# EasyEDA Pro project Adorkable_Base_V2.eprj

# Schematic Schematic1
Board Name: Board1; Create Date: 2024-12-17; Page Name: P1; Project Name: Adorkable_Base_V2; Schematic Name: Schematic1; Update Date: 2025-04-10; Company: 嘉立创EDA; Page Size: A4; Version: V1.0
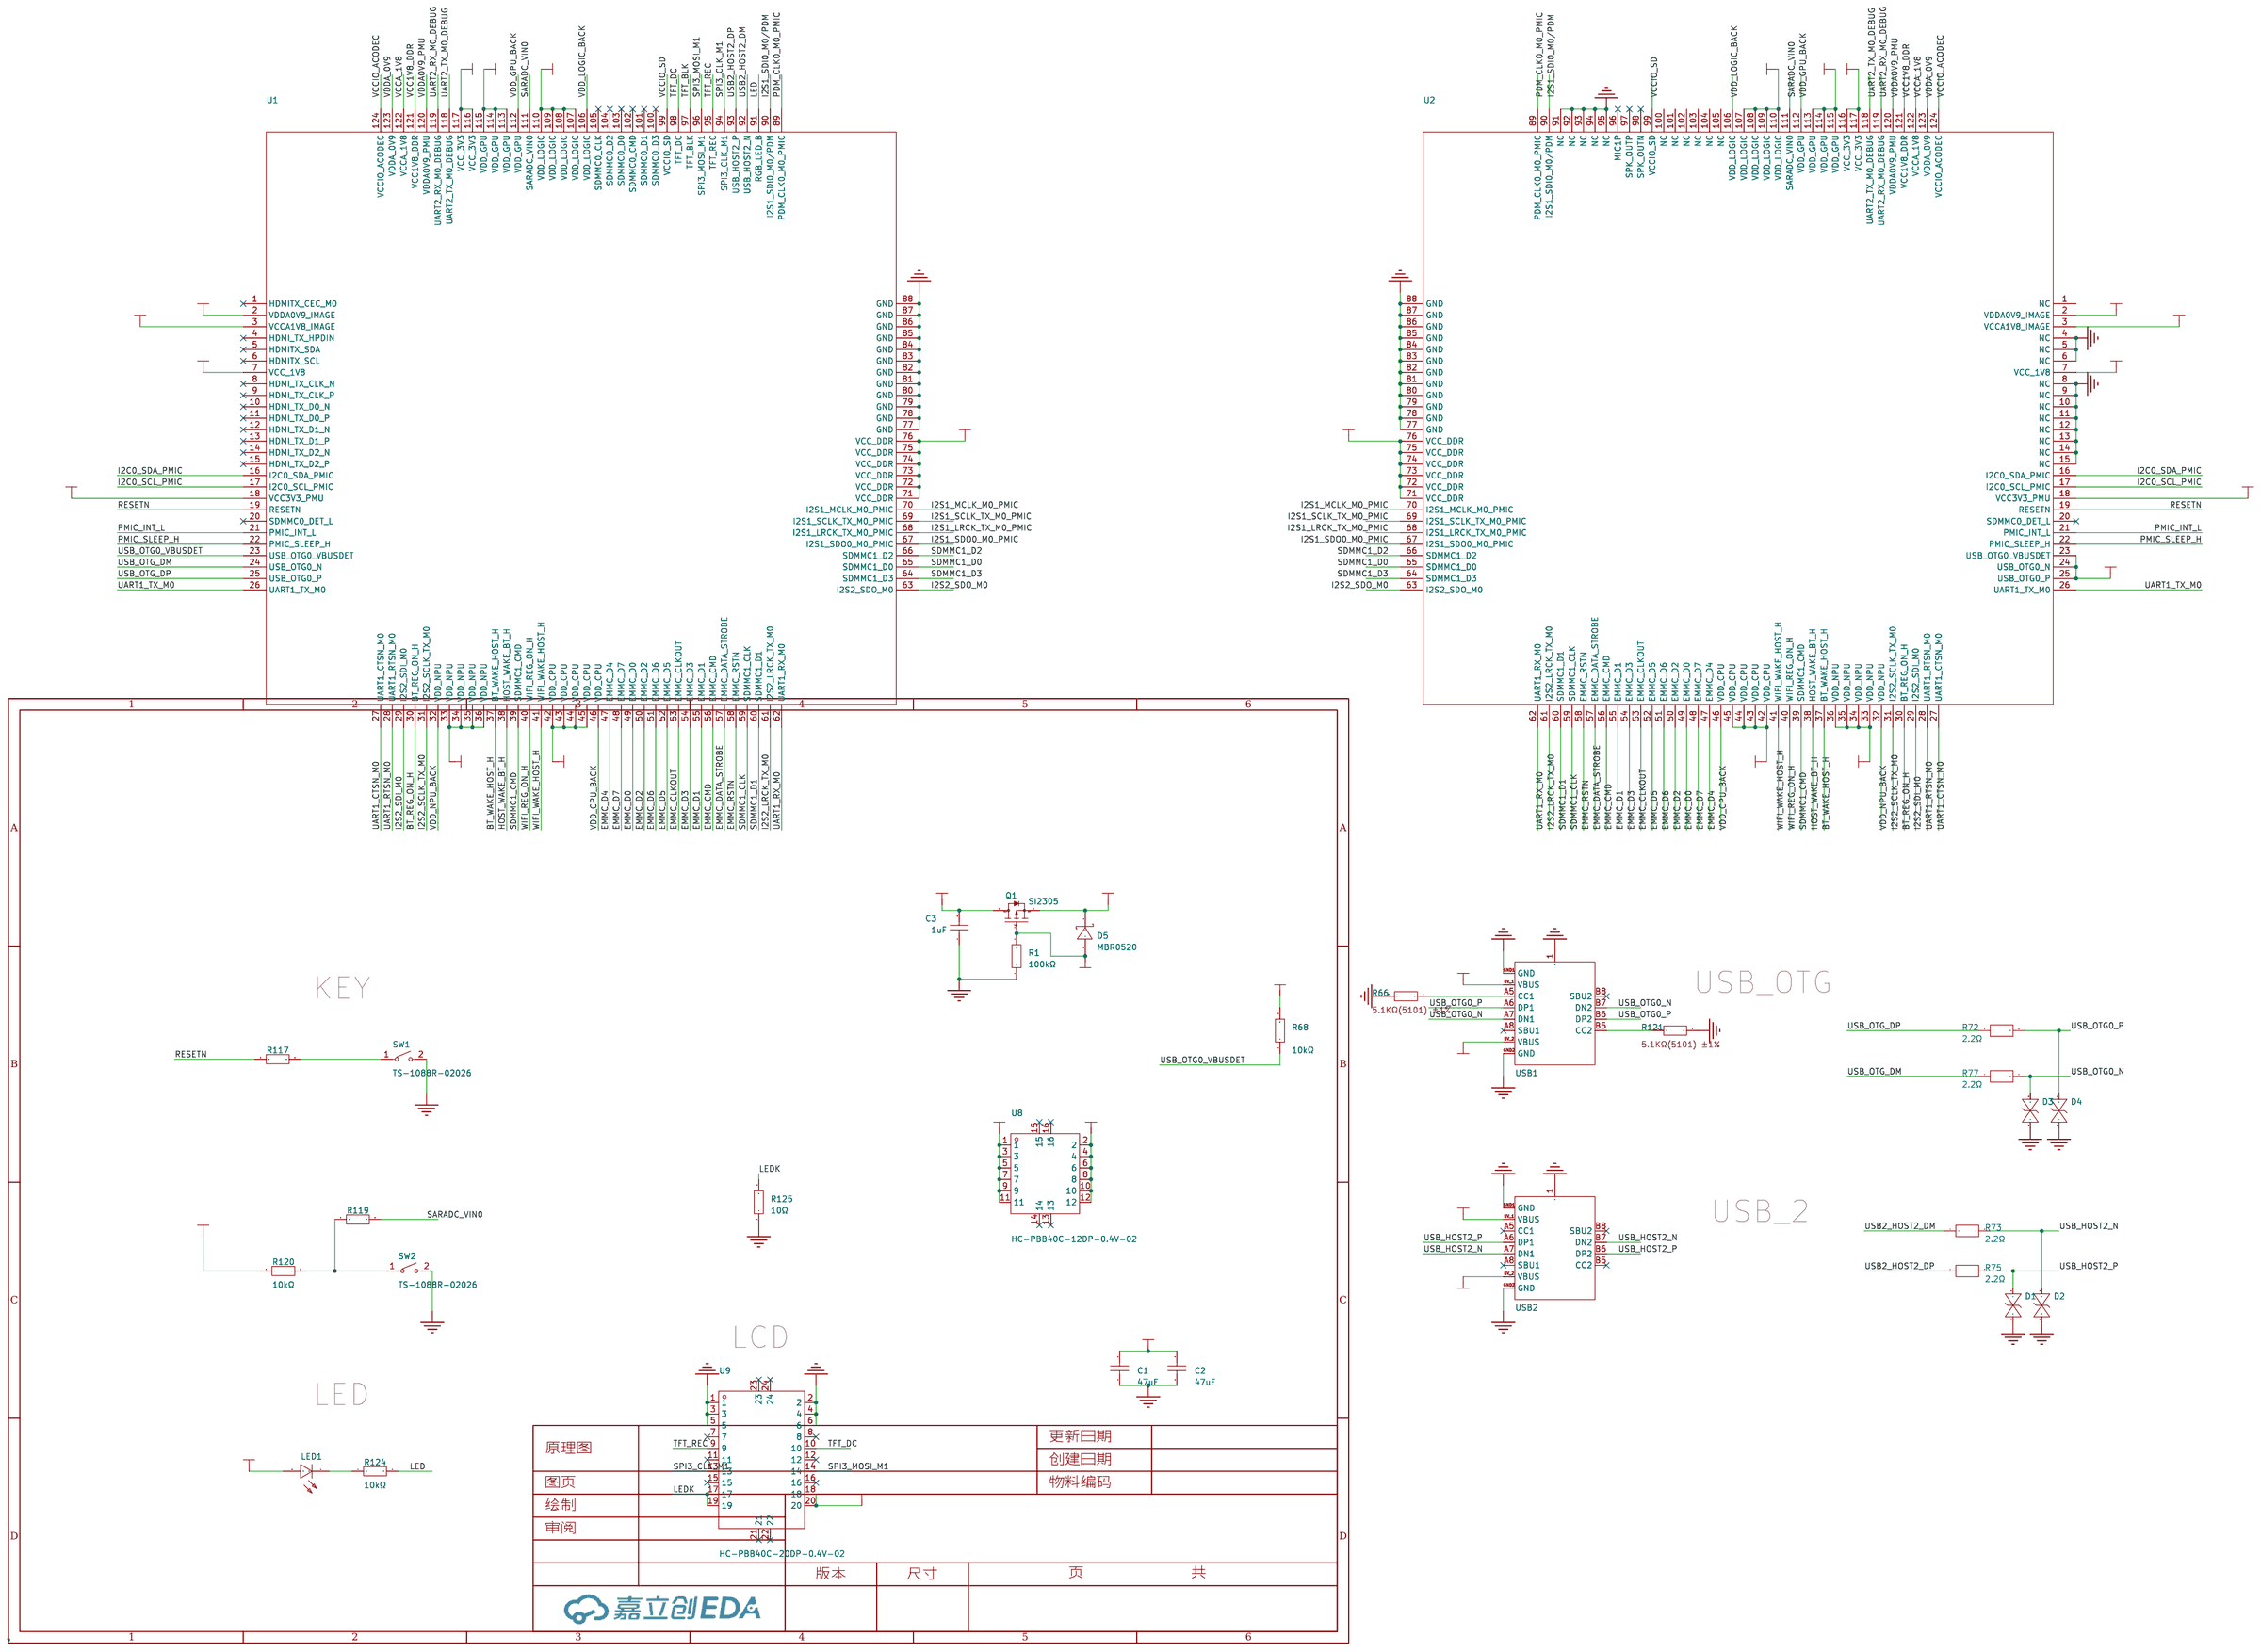
[diagram p0: schematic sheet]

## Parts
C1  47uF  [C0603]
C2  47uF  [C0603]
C3  1uF  [R0402]
D1  KLXES15AAA1  [R0402]
D2  KLXES15AAA1  [R0402]
D3  KLXES15AAA1  [R0402]
D4  KLXES15AAA1  [R0402]
D5  MBR0520  [SOD-123_L2.8-W1.8-LS3.7-RD]
LED1  19-217/GHC-YR1S2/3T  [LED0603-RD]
Q1  SI2305  [SOT-23-3_L2.9-W1.3-P1.90-LS2.4-BR]
R1  100kΩ  [R0402]
R66  0402WGF5101TCE  [R0402]
R68  10kΩ  [R0402]
R72  2.2Ω  [R0402]
R73  2.2Ω  [R0402]
R75  2.2Ω  [R0402]
R77  2.2Ω  [R0402]
R117  0402WGF1000TCE  [R0402]
R119  0402WGF1000TCE  [R0402]
R120  10kΩ  [R0402]
R121  0402WGF5101TCE  [R0402]
R124  10kΩ  [R0402]
R125  10Ω  [R0402]
SW1  TS-1088R-02026  [SW-SMD_L3.9-W3.0-P4.45]
SW2  TS-1088R-02026  [SW-SMD_L3.9-W3.0-P4.45]
U1  -  [Core]
U2  -  [EXP]
U8  HC-PBB40C-12DP-0.4V-02  [CONN-SMD_12P-P0.40_HCTL_HC-PBB40C-12DP-0.4V-02]
U9  HC-PBB40C-20DP-0.4V-02  [CONN-SMD_20P-P0.40_HCTL_HC-PBB40C-20DP-0.4V-02]
USB1  -  [TYPE-C-SMD_TYPE-CF3.1]
USB2  -  [TYPE-C-SMD_TYPE-CF3.1]

## Library data of the parts
C1 C2 = GRM188R60J476ME15D: LCSC Part Name: 47uF ±20% 6.3V; Supplier Part: C140782; Manufacturer: muRata(村田); Supplier Footprint: 0603; JLCPCB Part Class: 扩展库; Datasheet: https://atta.szlcsc.com/upload/public/pdf/source/20171113/C140782_15105612981581115778.pdf; Supplier: LCSC; Tolerance: ±20%; Voltage Rated: 6.3V; Temperature Coefficient: X5R
C3 = CL05A105KP5NNNC: 容值:1uF;精度:±10%;额定电压:10V;材质(温度系数):X5R;; LCSC Part Name: 1uF ±10% 10V; Supplier Part: C14445; Manufacturer: SAMSUNG(三星); Supplier Footprint: 0402; JLCPCB Part Class: 扩展库; Datasheet: https://atta.szlcsc.com/upload/public/pdf/source/20160103/1457707670698.pdf; Supplier: LCSC; Tolerance: ±10%; Voltage Rated: 10V; Temperature Coefficient: X5R
D1-D4 = KLXES15AAA1: 极性:双向;反向截止电压(Vrwm):5V;钳位电压(Vc)@Ipp:40V;; Supplier Part: C2892490; Manufacturer: KUU; Supplier Footprint: 0402; JLCPCB Part Class: Extended Part; Datasheet: https://atta.szlcsc.com/upload/public/pdf/source/20210908/40FD94D5521B4EF0ED53BC030E77ED53.pdf; Supplier: LCSC; Polarity: 双向; Reverse Stand-Off Voltage (Vrwm): 5V; Clamping Voltage@Ipp: 40V
D5 = MBR0520_C77335: 正向压降(Vf):450mV@500mA;直流反向耐压(Vr):20V;平均整流电流(Io):500mA;; LCSC Part Name: 电压:20V 电流:500mA; Supplier Part: C77335; Manufacturer: CJ(江苏长电/长晶); Supplier Footprint: SOD-123; Datasheet: https://atta.szlcsc.com/upload/public/pdf/source/20160702/1467448303432.pdf; Supplier: LCSC; Forward Voltage (Vf@If): 450mV@500mA; Reverse Voltage (Vr): 20V; Average Rectified Current (Io): 500mA
LED1 = 19-217/GHC-YR1S2/3T: 发光颜色:翠绿;二极管配置:-;主波长:520nm~535nm;色温:-;功率:110mW;安装方式:-;; Supplier Part: C72043; Manufacturer: EVERLIGHT(亿光); Supplier Footprint: 0603; JLCPCB Part Class: Basic Part; Datasheet: https://atta.szlcsc.com/upload/public/pdf/source/20160507/1462613613780.pdf; Supplier: LCSC; Emitted Color: 翠绿; Lens Color: 无色透明; Dominant Wavelength: 520nm~535nm; Peak Wavelength: 518nm; Forward Current: 20mA; Power Dissipation: 110mW; Viewing Angle: 120°; Operating Temperature: -40℃~+85℃
Q1 = SI2305_C181088: 类型:1个P沟道;漏源电压(Vdss):12V;连续漏极电流(Id):4.1A;功率(Pd):350mW;导通电阻(RDS(on)@Vgs,Id):90mΩ@1.8V,2A;阈值电压(Vgs(th)@Id):900mV@250uA;; LCSC Part Name: 1个P沟道 耐压:12V 电流:4.1A; Supplier Part: C181088; Manufacturer: Hottech(合科泰); Supplier Footprint: SOT-23; JLCPCB Part Class: 扩展库; Datasheet: https://atta.szlcsc.com/upload/public/pdf/source/20180131/C181088_15173931930011329217.pdf; Supplier: LCSC; Type: 1个P沟道; Drain Source Voltage (Vdss): 12V; Continuous Drain Current (Id): 4.1A; Power Dissipation (Pd): 350mW; Drain Source On Resistance (RDS(on)@Vgs,Id): 90mΩ@1.8V,2A; Gate Threshold Voltage (Vgs(th)@Id): 900mV@250uA
R1 = 0402WGF1003TCE: 电阻类型:厚膜电阻;阻值:100kΩ;精度:±1%;功率:62.5mW;最大工作电压:50V;温度系数:±100ppm/℃;; LCSC Part Name: 100kΩ ±1% 62.5mW 厚膜电阻; Supplier Part: C25741; Manufacturer: UNI-ROYAL(厚声); Supplier Footprint: 0402; JLCPCB Part Class: 基础库; Datasheet: https://atta.szlcsc.com/upload/public/pdf/source/20200306/C422600_1E6D84923E4A46A82E41ADD87F860B5C.pdf; Supplier: LCSC; Type: 厚膜电阻; Tolerance: ±1%; Power(Watts): 62.5mW; Overload Voltage (Max): 50V; Temperature Coefficient: ±100ppm/℃; Operating Temperature Range: -55℃~+155℃
R66 R121 = 0402WGF5101TCE: LCSC Part Name: 5.1KΩ(5101) ±1%; Supplier Part: C25905; Manufacturer: UNI-ROYAL(厚声); Supplier Footprint: 0402; JLCPCB Part Class: Basic Part; Datasheet: https://atta.szlcsc.com/upload/public/pdf/source/20170920/C25905_1505895107382980911.pdf; Supplier: LCSC
R68 = CRCW040210K0FKED: 电阻类型:厚膜电阻;阻值:10kΩ;精度:±1%;功率:63mW;温度系数:±100ppm/K;最大工作电压:50V;工作温度范围:-55℃~+155℃;; LCSC Part Name: 10kΩ ±1% 63mW; Supplier Part: C71617; Manufacturer: VISHAY(威世); Supplier Footprint: 0402; JLCPCB Part Class: 扩展库; Datasheet: https://atta.szlcsc.com/upload/public/pdf/source/20180224/C71617_15194370300791364062.pdf; Supplier: LCSC; Type: 厚膜电阻; Tolerance: ±1%; Power(Watts): 63mW; Temperature Coefficient: ±100ppm/K; Overload Voltage (Max): 50V; Operating Temperature Range: -55℃~+155℃
R72 R73 R75 R77 = ERJ2GEJ2R2X: 电阻类型:厚膜电阻;阻值:2.2Ω;精度:±5%;功率:100mW;温度系数:-100ppm/℃~+600ppm/℃;最大工作电压:-;工作温度范围:-55℃~+155℃;; LCSC Part Name: 2.2Ω ±5% 100mW; Supplier Part: C412897; Manufacturer: PANASONIC(松下); Supplier Footprint: 0402; JLCPCB Part Class: Extended Part; Datasheet: https://atta.szlcsc.com/upload/public/pdf/source/20190820/C412897_57E183A07438428D747B4E51D31956B4.pdf; Supplier: LCSC; Type: 厚膜电阻; Tolerance: ±5%; Power(Watts): 100mW; Temperature Coefficient: -100ppm/℃~+600ppm/℃; Operating Temperature Range: -55℃~+155℃
R117 = 0402WGF1000TCE: Supplier: LCSC; Supplier Part: C25076; Supplier Footprint: 0402; JLCPCB Part Class: Basic Part; LCSC Part Name: 100Ω(1000) ±1%; Datasheet: https://atta.szlcsc.com/upload/public/pdf/source/20170920/C25076_1505901197574982707.pdf; Manufacturer: UNI-ROYAL(厚声)
R119 = 0402WGF1000TCE: Supplier: LCSC; Supplier Part: C25076; Supplier Footprint: 0402; JLCPCB Part Class: Basic Part; LCSC Part Name: 100Ω(1000) ±1% 编带; Datasheet: https://atta.szlcsc.com/upload/public/pdf/source/20170920/C25076_1505901197574982707.pdf; Manufacturer: UNI-ROYAL(厚声)
R120 R124 = 0402WGF1002TCE: 电阻类型:厚膜电阻;阻值:10kΩ;精度:±1%;功率:62.5mW;; LCSC Part Name: 10kΩ ±1% 62.5mW; Supplier Part: C25744; Manufacturer: UNI-ROYAL(厚声); Supplier Footprint: 0402; JLCPCB Part Class: 基础库; Datasheet: https://atta.szlcsc.com/upload/public/pdf/source/20200306/C422600_1E6D84923E4A46A82E41ADD87F860B5C.pdf; Supplier: LCSC; Type: 厚膜电阻; Tolerance: ±1%; Power(Watts): 62.5mW; Temperature Coefficient: ±100ppm/℃; Overload Voltage (Max): 50V; Operating Temperature Range: -55℃~+155℃
R125 = 0402WGF100JTCE: LCSC Part Name: 10Ω ±1% 62.5mW 厚膜电阻; Supplier Part: C25077; Manufacturer: UNI-ROYAL(厚声); Supplier Footprint: 0402; JLCPCB Part Class: 基础库; Datasheet: https://atta.szlcsc.com/upload/public/pdf/source/20200306/C422600_1E6D84923E4A46A82E41ADD87F860B5C.pdf; Supplier: LCSC; Type: 厚膜电阻; Tolerance: ±1%; Power(Watts): 62.5mW; Overload Voltage (Max): 50V; Temperature Coefficient: ±200ppm/℃; Operating Temperature Range: -55℃~+155℃
SW1 SW2 = TS-1088R-02026: LCSC Part Name: 3.9*2.93*2mm 立贴 轻触开关; Supplier Part: C455280; Manufacturer: XUNPU(讯普); Supplier Footprint: SMD,3x4mm; JLCPCB Part Class: 扩展库; Datasheet: https://atta.szlcsc.com/upload/public/pdf/source/20191118/C455281_EC5379764BC1462550DF64BBBFEA9579.pdf; Supplier: LCSC; Circuit: 单刀单掷; Actuator Style: 圆形按钮; Mounting Style: 立贴; Switch Length: 3.9mm; Switch Width: 2.93mm; Switch Height: 2mm; Contact Current: 50mA; Voltage Rating (DC): 12V
U1 = Core
U2 = EXP
U8 = HC-PBB40C-12DP-0.4V-02: PIN总数:12P;间距:0.4mm;安装方式:立贴;排数:2;额定电流:300mA;工作温度:-35℃~+85℃;; LCSC Part Name: PIN:12P 间距:0.4mm 立贴; Supplier Part: C19089227; Manufacturer: HCTL(华灿天禄); Supplier Footprint: SMD,P=0.4mm; JLCPCB Part Class: 扩展库; Datasheet: https://atta.szlcsc.com/upload/public/pdf/source/20231026/4BDE2190AA6E7694F187A7FBDCD76BE9.pdf; Supplier: LCSC; Number of Pins: 12P; Pitch: 0.4mm; Connection Type: 槽型对接; Mounting Type: 立贴; Number of Rows: 2; Current Rating: 300mA; System Fit Height: 2.5mm；3mm；4mm；3.5mm；2mm；1.5mm; Contact Plating: 金; Operating Temperature: -35℃~+85℃
U9 = HC-PBB40C-20DP-0.4V-02: LCSC Part Name: PIN:20P 间距:0.4mm 立贴; Supplier Part: C19089228; Manufacturer: HCTL(华灿天禄); Supplier Footprint: SMD,P=0.4mm; JLCPCB Part Class: 扩展库; Datasheet: https://atta.szlcsc.com/upload/public/pdf/source/20231026/4BDE2190AA6E7694F187A7FBDCD76BE9.pdf; Supplier: LCSC; Number of Pins: 20P; Pitch: 0.4mm; Connection Type: 槽型对接; Mounting Type: 立贴; Number of Rows: 2; Current Rating: 300mA; System Fit Height: 2.5mm；3mm；4mm；3.5mm；2mm；1.5mm; Contact Plating: 金; Operating Temperature: -35℃~+85℃
USB1 USB2 = TYPE-C-16PIN

## Nets
GND: C1.1 C2.1 C3.1 D1.1(K) D2.1(K) D3.1(K) D4.1(K) R1.1 R66.2 R121.1 R125.1 SW1.2 SW2.2 U1.77(GND) U1.78(GND) U1.79(GND) U1.80(GND) U1.81(GND) U1.82(GND) U1.83(GND) U1.84(GND) U1.85(GND) U1.86(GND) U1.87(GND) U1.88(GND) U2.4(NC) U2.5(NC) U2.6(NC) U2.8(NC) U2.9(NC) U2.10(NC) U2.11(NC) U2.12(NC) U2.13(NC) U2.14(NC) U2.15(NC) U2.77(GND) U2.78(GND) U2.79(GND) U2.80(GND) U2.81(GND) U2.82(GND) U2.83(GND) U2.84(GND) U2.85(GND) U2.86(GND) U2.87(GND) U2.88(GND) U2.91(NC) U2.92(NC) U2.93(NC) U2.94(NC) U2.95(NC) U9.1 U9.2 U9.3 U9.4 U9.5 U9.6 USB1.1(EH) USB1.GND1(GND) USB1.GND2(GND) USB2.1(EH) USB2.GND1(GND) USB2.GND2(GND)
VCC1V8_DDR: U1.121(VCC1V8_DDR) U2.121(VCC1V8_DDR)
VCC3V3_PMU: U1.18(VCC3V3_PMU) U2.18(VCC3V3_PMU)
VCC_1V8: U1.7(VCC_1V8) U2.7(VCC_1V8)
VCC_3V3: LED1.2(A) U1.116(VCC_3V3) U1.117(VCC_3V3) U2.116(VCC_3V3) U2.117(VCC_3V3) U9.18 U9.20
VCC_5V: C1.2 C2.2 D5.2(A) Q1.1(G) R1.2 R68.2 U8.1 U8.3 U8.5 U8.7 U8.9 U8.11 USB1.5V_1(VBUS) USB1.5V_2(VBUS) USB2.5V_1(VBUS) USB2.5V_2(VBUS)
VCC_DDR: U1.71(VCC_DDR) U1.72(VCC_DDR) U1.73(VCC_DDR) U1.74(VCC_DDR) U1.75(VCC_DDR) U1.76(VCC_DDR) U2.71(VCC_DDR) U2.72(VCC_DDR) U2.73(VCC_DDR) U2.74(VCC_DDR) U2.75(VCC_DDR) U2.76(VCC_DDR)
VCC_IN: D5.1(K) Q1.2(S) U2.23(USB_OTG0_VBUSDET) U2.24(USB_OTG0_N) U2.25(USB_OTG0_P)
VCC_OUT: C3.2 Q1.3(D) U8.2 U8.4 U8.6 U8.8 U8.10 U8.12
VCCA1V8_IMAGE: U1.3(VCCA1V8_IMAGE) U2.3(VCCA1V8_IMAGE)
VCCA_1V8: R120.1 U1.122(VCCA_1V8) U2.122(VCCA_1V8)
VCCIO_ACODEC: U1.124(VCCIO_ACODEC) U2.124(VCCIO_ACODEC)
VCCIO_SD: U1.99(VCCIO_SD) U2.99(VCCIO_SD)
VDD_CPU: U1.42(VDD_CPU) U1.43(VDD_CPU) U1.44(VDD_CPU) U1.45(VDD_CPU) U2.42(VDD_CPU) U2.43(VDD_CPU) U2.44(VDD_CPU) U2.45(VDD_CPU)
VDD_CPU_BACK: U1.46(VDD_CPU) U2.46(VDD_CPU)
VDD_GPU: U1.113(VDD_GPU) U1.114(VDD_GPU) U1.115(VDD_GPU) U2.113(VDD_GPU) U2.114(VDD_GPU) U2.115(VDD_GPU)
VDD_GPU_BACK: U1.112(VDD_GPU) U2.112(VDD_GPU)
VDD_LOGIC: U1.107(VDD_LOGIC) U1.108(VDD_LOGIC) U1.109(VDD_LOGIC) U1.110(VDD_LOGIC) U2.107(VDD_LOGIC) U2.108(VDD_LOGIC) U2.109(VDD_LOGIC) U2.110(VDD_LOGIC)
VDD_LOGIC_BACK: U1.106(VDD_LOGIC) U2.106(VDD_LOGIC)
VDD_NPU: U1.33(VDD_NPU) U1.34(VDD_NPU) U1.35(VDD_NPU) U1.36(VDD_NPU) U2.33(VDD_NPU) U2.34(VDD_NPU) U2.35(VDD_NPU) U2.36(VDD_NPU)
VDD_NPU_BACK: U1.32(VDD_NPU) U2.32(VDD_NPU)
VDDA0V9_IMAGE: U1.2(VDDA0V9_IMAGE) U2.2(VDDA0V9_IMAGE)
VDDA0V9_PMU: U1.120(VDDA0V9_PMU) U2.120(VDDA0V9_PMU)
VDDA_0V9: U1.123(VDDA_0V9) U2.123(VDDA_0V9)
BT_REG_ON_H: U1.30(BT_REG_ON_H) U2.30(BT_REG_ON_H)
BT_WAKE_HOST_H: U1.37(BT_WAKE_HOST_H) U2.37(BT_WAKE_HOST_H)
EMMC_CLKOUT: U1.53(EMMC_CLKOUT) U2.53(EMMC_CLKOUT)
EMMC_CMD: U1.56(EMMC_CMD) U2.56(EMMC_CMD)
EMMC_D0: U1.49(EMMC_D0) U2.49(EMMC_D0)
EMMC_D1: U1.55(EMMC_D1) U2.55(EMMC_D1)
EMMC_D2: U1.50(EMMC_D2) U2.50(EMMC_D2)
EMMC_D3: U1.54(EMMC_D3) U2.54(EMMC_D3)
EMMC_D4: U1.47(EMMC_D4) U2.47(EMMC_D4)
EMMC_D5: U1.52(EMMC_D5) U2.52(EMMC_D5)
EMMC_D6: U1.51(EMMC_D6) U2.51(EMMC_D6)
EMMC_D7: U1.48(EMMC_D7) U2.48(EMMC_D7)
EMMC_DATA_STROBE: U1.57(EMMC_DATA_STROBE) U2.57(EMMC_DATA_STROBE)
EMMC_RSTN: U1.58(EMMC_RSTN) U2.58(EMMC_RSTN)
HOST_WAKE_BT_H: U1.38(HOST_WAKE_BT_H) U2.38(HOST_WAKE_BT_H)
I2C0_SCL_PMIC: U1.17(I2C0_SCL_PMIC) U2.17(I2C0_SCL_PMIC)
I2C0_SDA_PMIC: U1.16(I2C0_SDA_PMIC) U2.16(I2C0_SDA_PMIC)
I2S1_LRCK_TX_M0_PMIC: U1.68(I2S1_LRCK_TX_M0_PMIC) U2.68(I2S1_LRCK_TX_M0_PMIC)
I2S1_MCLK_M0_PMIC: U1.70(I2S1_MCLK_M0_PMIC) U2.70(I2S1_MCLK_M0_PMIC)
I2S1_SCLK_TX_M0_PMIC: U1.69(I2S1_SCLK_TX_M0_PMIC) U2.69(I2S1_SCLK_TX_M0_PMIC)
I2S1_SDI0_M0/PDM: U1.90(I2S1_SDI0_M0/PDM) U2.90(I2S1_SDI0_M0/PDM)
I2S1_SDO0_M0_PMIC: U1.67(I2S1_SDO0_M0_PMIC) U2.67(I2S1_SDO0_M0_PMIC)
I2S2_LRCK_TX_M0: U1.61(I2S2_LRCK_TX_M0) U2.61(I2S2_LRCK_TX_M0)
I2S2_SCLK_TX_M0: U1.31(I2S2_SCLK_TX_M0) U2.31(I2S2_SCLK_TX_M0)
I2S2_SDI_M0: U1.29(I2S2_SDI_M0) U2.29(I2S2_SDI_M0)
I2S2_SDO_M0: U1.63(I2S2_SDO_M0) U2.63(I2S2_SDO_M0)
LED: R124.2 U1.91(RGB_LED_B)
LEDK: R125.2 U9.17 U9.19
PDM_CLK0_M0_PMIC: U1.89(PDM_CLK0_M0_PMIC) U2.89(PDM_CLK0_M0_PMIC)
PMIC_INT_L: U1.21(PMIC_INT_L) U2.21(PMIC_INT_L)
PMIC_SLEEP_H: U1.22(PMIC_SLEEP_H) U2.22(PMIC_SLEEP_H)
RESETN: R117.1 U1.19(RESETN) U2.19(RESETN)
SARADC_VIN0: R119.2 U1.111(SARADC_VIN0) U2.111(SARADC_VIN0)
SDMMC1_CLK: U1.59(SDMMC1_CLK) U2.59(SDMMC1_CLK)
SDMMC1_CMD: U1.39(SDMMC1_CMD) U2.39(SDMMC1_CMD)
SDMMC1_D0: U1.65(SDMMC1_D0) U2.65(SDMMC1_D0)
SDMMC1_D1: U1.60(SDMMC1_D1) U2.60(SDMMC1_D1)
SDMMC1_D2: U1.66(SDMMC1_D2) U2.66(SDMMC1_D2)
SDMMC1_D3: U1.64(SDMMC1_D3) U2.64(SDMMC1_D3)
SPI3_CLK_M1: U1.94(SPI3_CLK_M1) U9.13
SPI3_MOSI_M1: U1.96(SPI3_MOSI_M1) U9.14
TFT_BLK: U1.97(TFT_BLK)
TFT_DC: U1.98(TFT_DC) U9.10
TFT_REC: U1.95(TFT_REC) U9.9
UART1_CTSN_M0: U1.27(UART1_CTSN_M0) U2.27(UART1_CTSN_M0)
UART1_RTSN_M0: U1.28(UART1_RTSN_M0) U2.28(UART1_RTSN_M0)
UART1_RX_M0: U1.62(UART1_RX_M0) U2.62(UART1_RX_M0)
UART1_TX_M0: U1.26(UART1_TX_M0) U2.26(UART1_TX_M0)
UART2_RX_M0_DEBUG: U1.119(UART2_RX_M0_DEBUG) U2.119(UART2_RX_M0_DEBUG)
UART2_TX_M0_DEBUG: U1.118(UART2_TX_M0_DEBUG) U2.118(UART2_TX_M0_DEBUG)
USB2_HOST2_DM: R73.1 U1.92(USB_HOST2_N)
USB2_HOST2_DP: R75.1 U1.93(USB_HOST2_P)
USB_HOST2_N: D2.2(A) R73.2 USB2.A7(DN1) USB2.B7(DN2)
USB_HOST2_P: D1.2(A) R75.2 USB2.A6(DP1) USB2.B6(DP2)
USB_OTG0_N: D3.2(A) R77.2 USB1.A7(DN1) USB1.B7(DN2)
USB_OTG0_P: D4.2(A) R72.2 USB1.A6(DP1) USB1.B6(DP2)
USB_OTG0_VBUSDET: R68.1 U1.23(USB_OTG0_VBUSDET)
USB_OTG_DM: R77.1 U1.24(USB_OTG0_N)
USB_OTG_DP: R72.1 U1.25(USB_OTG0_P)
WIFI_REG_ON_H: U1.40(WIFI_REG_ON_H) U2.40(WIFI_REG_ON_H)
WIFI_WAKE_HOST_H: U1.41(WIFI_WAKE_HOST_H) U2.41(WIFI_WAKE_HOST_H)
$LED1_1: LED1.1(C) R124.1
$R66_1: R66.1 USB1.A5(CC1)
$R117_2: R117.2 SW1.1
$R119_1: R119.1 R120.2 SW2.1
$R121_2: R121.2 USB1.B5(CC2)

Not connected (* = marked no-connect by the designer): U1 1(HDMITX_CEC_M0)* 4(HDMI_TX_HPDIN)* 5(HDMITX_SDA)* 6(HDMITX_SCL)* 8(HDMI_TX_CLK_N)* 9(HDMI_TX_CLK_P)* 10(HDMI_TX_D0_N)* 11(HDMI_TX_D0_P)* 12(HDMI_TX_D1_N)* 13(HDMI_TX_D1_P)* 14(HDMI_TX_D2_N)* 15(HDMI_TX_D2_P)* 20(SDMMC0_DET_L)* 100(SDMMC0_D3)* 101(SDMMC0_D1)* 102(SDMMC0_CMD)* 103(SDMMC0_D0)* 104(SDMMC0_D2)* 105(SDMMC0_CLK)*; U2 1(NC) 20(SDMMC0_DET_L)* 96(MIC1P)* 97(SPK_OUTP)* 98(SPK_OUTN)* 100(NC) 101(NC) 102(NC) 103(NC) 104(NC) 105(NC); U8 13* 14* 15* 16*; U9 7* 8* 11* 12* 15* 16* 21* 22* 23* 24*; USB1 A8(SBU1)* B8(SBU2)*; USB2 A5(CC1)* A8(SBU1)* B5(CC2)* B8(SBU2)*

## Notes on the sheet
- USB_OTG
- KEY
- USB_2
- LCD
- LED

# Board PCB1
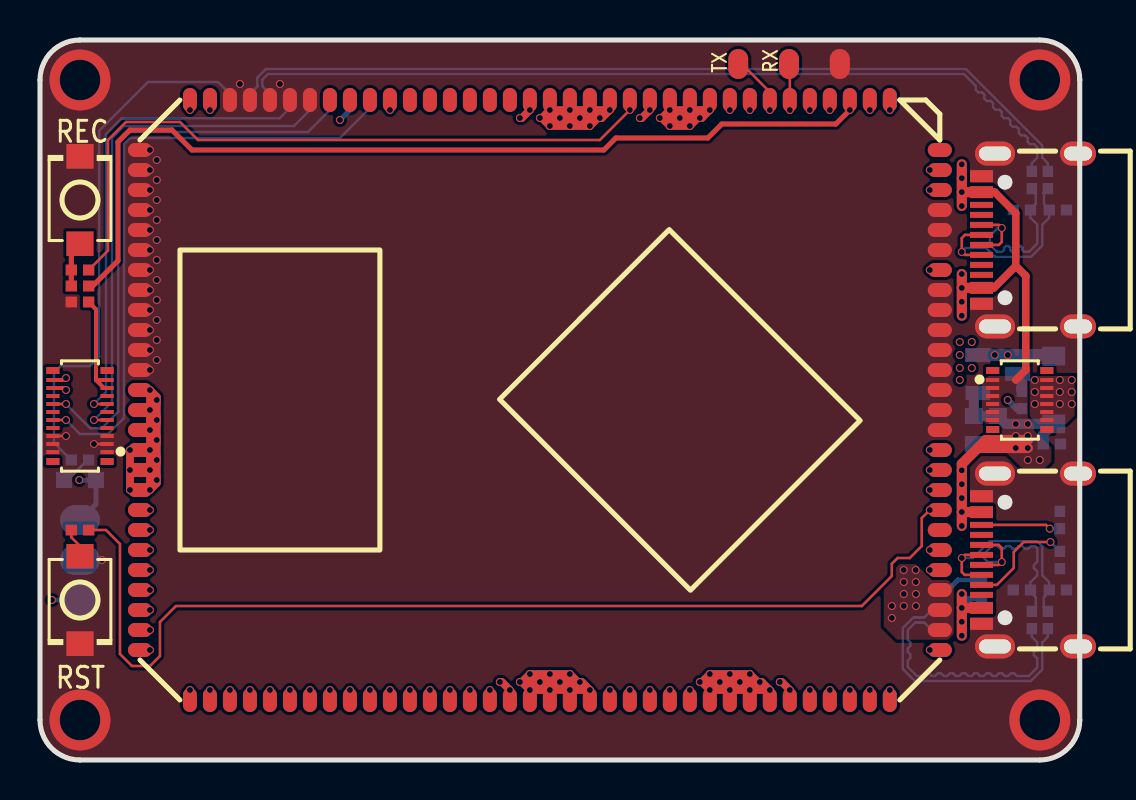
[diagram p1: board, top side]
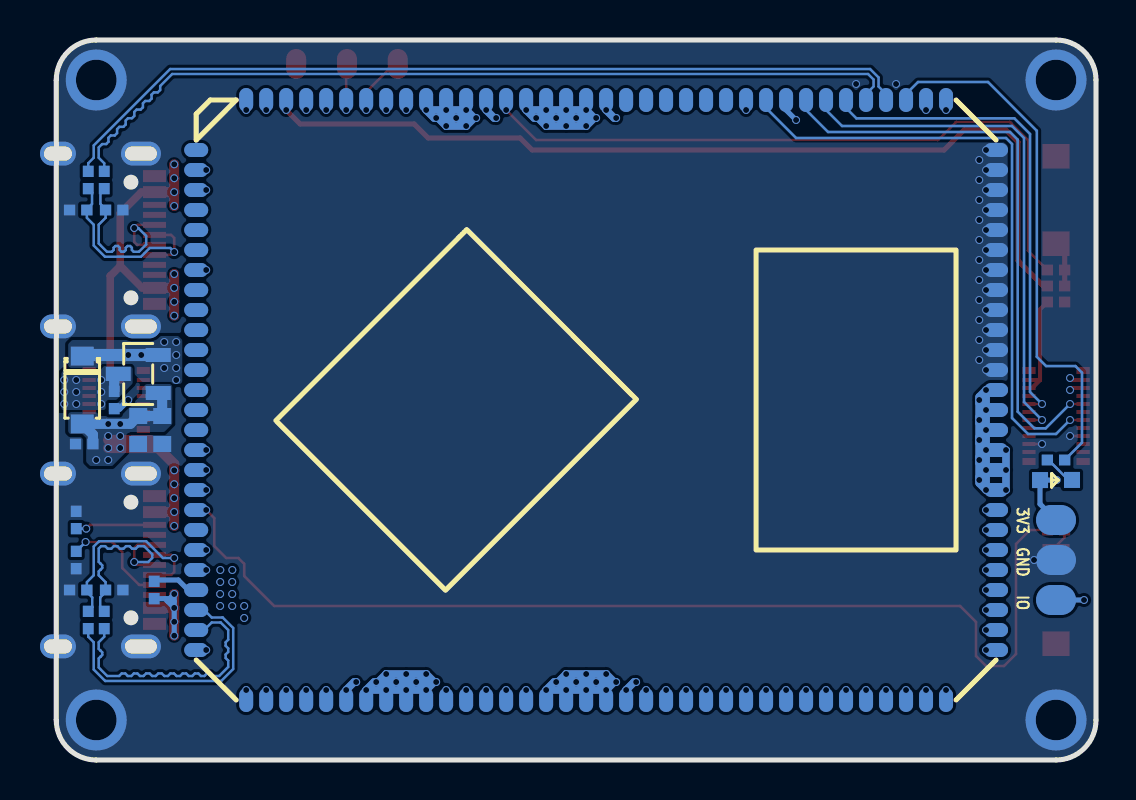
[diagram p2: board, bottom side, seen from below]

Outline 52 x 36 mm; copper layers: Top Layer, PWR, GND, Bottom Layer. Coordinates in mm from the lower left corner of the outline.
Outline path: 0,34 arc(0.59,35.41) 2,36 50,36 arc(51.41,35.41) 52,34 52,2 arc(51.41,0.59) 50,0 2,0 arc(0.59,0.59) 0,2 0,34
Stack: Top Layer 0.035mm 外层铜厚1oz / Dielectric1 0.2104mm 7628 RC49% 8.6mil / PWR 0.0152mm 内层铜厚 / Dielectric2 1.065mm 1.1mm H/HOZ Copper / GND 0.0152mm 内层铜厚 / Dielectric3 0.2104mm 7628 RC49% 8.6mil / Bottom Layer 0.035mm 外层铜厚1oz

## Design rules (mm)
net USB_HOST2_P: USB_HOST2_0
net USB_HOST2_N: USB_HOST2_0
net USB_OTG0_N: USB_OTG_0
net USB_OTG0_P: USB_OTG_0
net USB_OTG_DP: USB_OTG_1
net USB2_HOST2_DM: USB_HOST2_1
net USB2_HOST2_DP: USB_HOST2_1
net USB_OTG_DM: USB_OTG_1
template: 自定义配置
spacing copperThickness1oz (default): track to track 0.102, other pairs 0 to 0.3
spacing copperThickness2oz: track to track 0.203, other pairs 0.152 to 0.3
track width copperThickness1oz (default): min 0.127, default 0.127, max 2.54
track width copperThickness2oz: min 0.127, default 0.127, max 2.54
differential pair differentialPair (default): width min 0.102, default 0.122, max 2.54; gap min 0.127, default 0.127
via viaSize (default): diameter min 0.399, default 0.399, max 10; hole min 0.3, default 0.3, max 10
net GND uses VCC

## Placement (name value [footprint] x y rotation side)
C1  47uF  [C0603]  46.7 16.5 90 bottom
C2  47uF  [C0603]  47.9 16.5 90 bottom
C3  1uF  [R0402]  49.1 18 90 bottom
D1  KLXES15AAA1  [R0402]  49.1 27.5 0 bottom
D2  KLXES15AAA1  [R0402]  50.9 27.5 180 bottom
D3  KLXES15AAA1  [R0402]  50.9 8.5 180 bottom
D4  KLXES15AAA1  [R0402]  49.1 8.5 0 bottom
D5  MBR0520  [SOD-123_L2.8-W1.8-LS3.7-RD]  50.7 18.5 270 bottom
LED1  19-217/GHC-YR1S2/3T  [LED0603-RD]  2 14 0 bottom
NOREF  -  [Pad_e370]  37.46 34.8 90 top
NOREF#2  -  [Pad_e374]  40 34.8 90 top
NOREF#3  -  [Pad_e367]  34.92 34.8 90 top
NOREF#4  -  [Pad_e2043]  2 10 0 top
NOREF#5  -  [Pad_e2052]  2 12 0 top
NOREF#6  -  [Pad_e2041]  2 8 0 top
Q1  SI2305  [SOT-23-3_L2.9-W1.3-P1.90-LS2.4-BR]  47.9 19.3 180 bottom
R1  100kΩ  [R0402]  50.6 15.8 180 bottom
R66  0402WGF5101TCE  [R0402]  51 10 270 bottom
R68  10kΩ  [R0402]  47.1 8.5 270 bottom
R72  2.2Ω  [R0402]  49.6 7 90 bottom
R73  2.2Ω  [R0402]  50.4 29 270 bottom
R75  2.2Ω  [R0402]  49.6 29 270 bottom
R77  2.2Ω  [R0402]  50.4 7 90 bottom
R117  0402WGF1000TCE  [R0402]  2 11.5 180 top
R119  0402WGF1000TCE  [R0402]  2 24.5 0 top
R120  10kΩ  [R0402]  2 23.7 180 top
R121  0402WGF5101TCE  [R0402]  51 12 270 bottom
R124  10kΩ  [R0402]  2 15 180 bottom
R125  10Ω  [R0402]  2 22.9 0 top
SW1  TS-1088R-02026  [SW-SMD_L3.9-W3.0-P4.45]  2 8 270 top
SW2  TS-1088R-02026  [SW-SMD_L3.9-W3.0-P4.45]  2 28 90 top
U1  -  [Core]  45 3 180 bottom
U2  -  [EXP]  5 3 0 top
U8  HC-PBB40C-12DP-0.4V-02  [CONN-SMD_12P-P0.40_HCTL_HC-PBB40C-12DP-0.4V-02]  49 18 270 top
U9  HC-PBB40C-20DP-0.4V-02  [CONN-SMD_20P-P0.40_HCTL_HC-PBB40C-20DP-0.4V-02]  2 17.2 90 top
USB1  -  [TYPE-C-SMD_TYPE-CF3.1]  49.5 10 90 top
USB2  -  [TYPE-C-SMD_TYPE-CF3.1]  49.5 26 90 top

## Footprints (pads in the part's own frame, mm; a bottom-side part is the same pattern mirrored in y, then rotated)
C0603
  rect 0.8x0.9 smd: 1(-0.7,0) 2(0.7,0)
CONN-SMD_12P-P0.40_HCTL_HC-PBB40C-12DP-0.4V-02
  rect 0.2x0.66 smd: 1(-1,-1.355) 2(-1,1.355) 3(-0.6,-1.355) 4(-0.6,1.355) 5(-0.2,-1.355) 6(-0.2,1.355) 7(0.2,-1.355) 8(0.2,1.355) 9(0.6,-1.355) 10(0.6,1.355) 11(1,-1.355) 12(1,1.355)
  rect 0.35x0.66 smd: 13(1.475,1.355) 14(1.475,-1.355) 15(-1.475,-1.355) 16(-1.475,1.355)
CONN-SMD_20P-P0.40_HCTL_HC-PBB40C-20DP-0.4V-02
  rect 0.2x0.66 smd: 1(-1.8,-1.355) 2(-1.8,1.355) 3(-1.4,-1.355) 4(-1.4,1.355) 5(-1,-1.355) 6(-1,1.355) 7(-0.6,-1.355) 8(-0.6,1.355) 9(-0.2,-1.355) 10(-0.2,1.355) 11(0.2,-1.355) 12(0.2,1.355) 13(0.6,-1.355) 14(0.6,1.355) 15(1,-1.355) 16(1,1.355) 17(1.4,-1.355) 18(1.4,1.355) 19(1.8,-1.355) 20(1.8,1.355)
  rect 0.35x0.66 smd: 21(2.275,1.355) 22(2.275,-1.355) 23(-2.275,-1.355) 24(-2.275,1.355)
Core
  oval 1.2x0.7 smd: 1(0,27.5) 2(0,26.5) 3(0,25.5) 4(0,24.5) 5(0,23.5) 6(0,22.5) 7(0,21.5) 8(0,20.5) 9(0,19.5) 10(0,18.5) 11(0,17.5) 12(0,16.5) 13(0,15.5) 14(0,14.5) 15(0,13.5) 16(0,12.5) 17(0,11.5) 18(0,10.5) 19(0,9.5) 20(0,8.5) 21(0,7.5) 22(0,6.5) 23(0,5.5) 24(0,4.5) 25(0,3.5) 26(0,2.5) 63(40,2.5) 64(40,3.5) 65(40,4.5) 66(40,5.5) 67(40,6.5) 68(40,7.5) 69(40,8.5) 70(40,9.5) 71(40,10.5) 72(40,11.5) 73(40,12.5) 74(40,13.5) 75(40,14.5) 76(40,15.5) 77(40,16.5) 78(40,17.5) 79(40,18.5) 80(40,19.5) 81(40,20.5) 82(40,21.5) 83(40,22.5) 84(40,23.5) 85(40,24.5) 86(40,25.5) 87(40,26.5) 88(40,27.5)
  oval 0.7x1.2 smd: 27(2.5,0) 28(3.5,0) 29(4.5,0) 30(5.5,0) 31(6.5,0) 32(7.5,0) 33(8.5,0) 34(9.5,0) 35(10.5,0) 36(11.5,0) 37(12.5,0) 38(13.5,0) 39(14.5,0) 40(15.5,0) 41(16.5,0) 42(17.5,0) 43(18.5,0) 44(19.5,0) 45(20.5,0) 46(21.5,0) 47(22.5,0) 48(23.5,0) 49(24.5,0) 50(25.5,0) 51(26.5,0) 52(27.5,0) 53(28.5,0) 54(29.5,0) 55(30.5,0) 56(31.5,0) 57(32.5,0) 58(33.5,0) 59(34.5,0) 60(35.5,0) 61(36.5,0) 62(37.5,0) 89(37.5,30) 90(36.5,30) 91(35.5,30) 92(34.5,30) 93(33.5,30) 94(32.5,30) 95(31.5,30) 96(30.5,30) 97(29.5,30) 98(28.5,30) 99(27.5,30) 100(26.5,30) 101(25.5,30) 102(24.5,30) 103(23.5,30) 104(22.5,30) 105(21.5,30) 106(20.5,30) 107(19.5,30) 108(18.5,30) 109(17.5,30) 110(16.5,30) 111(15.5,30) 112(14.5,30) 113(13.5,30) 114(12.5,30) 115(11.5,30) 116(10.5,30) 117(9.5,30) 118(8.5,30) 119(7.5,30) 120(6.5,30) 121(5.5,30) 122(4.5,30) 123(3.5,30) 124(2.5,30)
EXP
  oval 1.2x0.7 smd: 1(40,27.5) 2(40,26.5) 3(40,25.5) 4(40,24.5) 5(40,23.5) 6(40,22.5) 7(40,21.5) 8(40,20.5) 9(40,19.5) 10(40,18.5) 11(40,17.5) 12(40,16.5) 13(40,15.5) 14(40,14.5) 15(40,13.5) 16(40,12.5) 17(40,11.5) 18(40,10.5) 19(40,9.5) 20(40,8.5) 21(40,7.5) 22(40,6.5) 23(40,5.5) 24(40,4.5) 25(40,3.5) 26(40,2.5) 63(0,2.5) 64(0,3.5) 65(0,4.5) 66(0,5.5) 67(0,6.5) 68(0,7.5) 69(0,8.5) 70(0,9.5) 71(0,10.5) 72(0,11.5) 73(0,12.5) 74(0,13.5) 75(0,14.5) 76(0,15.5) 77(0,16.5) 78(0,17.5) 79(0,18.5) 80(0,19.5) 81(0,20.5) 82(0,21.5) 83(0,22.5) 84(0,23.5) 85(0,24.5) 86(0,25.5) 87(0,26.5) 88(0,27.5)
  oval 0.7x1.2 smd: 27(37.5,0) 28(36.5,0) 29(35.5,0) 30(34.5,0) 31(33.5,0) 32(32.5,0) 33(31.5,0) 34(30.5,0) 35(29.5,0) 36(28.5,0) 37(27.5,0) 38(26.5,0) 39(25.5,0) 40(24.5,0) 41(23.5,0) 42(22.5,0) 43(21.5,0) 44(20.5,0) 45(19.5,0) 46(18.5,0) 47(17.5,0) 48(16.5,0) 49(15.5,0) 50(14.5,0) 51(13.5,0) 52(12.5,0) 53(11.5,0) 54(10.5,0) 55(9.5,0) 56(8.5,0) 57(7.5,0) 58(6.5,0) 59(5.5,0) 60(4.5,0) 61(3.5,0) 62(2.5,0) 89(2.5,30) 90(3.5,30) 91(4.5,30) 92(5.5,30) 93(6.5,30) 94(7.5,30) 95(8.5,30) 96(9.5,30) 97(10.5,30) 98(11.5,30) 99(12.5,30) 100(13.5,30) 101(14.5,30) 102(15.5,30) 103(16.5,30) 104(17.5,30) 105(18.5,30) 106(19.5,30) 107(20.5,30) 108(21.5,30) 109(22.5,30) 110(23.5,30) 111(24.5,30) 112(25.5,30) 113(26.5,30) 114(27.5,30) 115(28.5,30) 116(29.5,30) 117(30.5,30) 118(31.5,30) 119(32.5,30) 120(33.5,30) 121(34.5,30) 122(35.5,30) 123(36.5,30) 124(37.5,30)
LED0603-RD
  rect 0.8x0.8 smd: 1(-0.799,-0.004) 2(0.799,0.004)
Pad_e367
  oval 1.5x1 smd: 1(0,0)
Pad_e370
  oval 1.5x1 smd: 2(0,0)
Pad_e374
  oval 1.5x1 smd: 3(0,0)
Pad_e2041
  oval 2x1.5 smd far side: 1(0,0)
Pad_e2043
  oval 2x1.5 smd far side: 2(0,0)
Pad_e2052
  oval 2x1.5 smd far side: 3(0,0)
R0402
  rect 0.566x0.54 smd: 1(-0.433,0) 2(0.433,0)
SOD-123_L2.8-W1.8-LS3.7-RD
  rect 0.95x1.15 smd: 1(-1.692,0) 2(1.692,0)
SOT-23-3_L2.9-W1.3-P1.90-LS2.4-BR
  rect 1.25x0.7 smd: 1(1,-0.95) 2(1,0.95) 3(-1,0)
SW-SMD_L3.9-W3.0-P4.45
  rect 1.23x1.36 smd: 1(-2.185,0) 2(2.185,0)
TYPE-C-SMD_TYPE-CF3.1
  oval 1.2x2 hole 0.7x1.6: 1(-4.32,1.738) 1(4.32,1.738)
  oval 1.2x1.8 hole 0.7x1.4: 1(-4.32,-2.413) 1(4.32,-2.413)
  rect 0.6x1.15 smd: 5V_1(-2.395,2.413) 5V_2(2.395,2.413) GND1(-3.195,2.413) GND2(3.195,2.413)
  rect 0.3x1.15 smd: A5(-1.245,2.413) A6(-0.245,2.413) A7(0.255,2.413) A8(1.255,2.413) B5(1.755,2.413) B6(0.755,2.413) B7(-0.745,2.413) B8(-1.745,2.413)

## Nets
As in the schematic, except:
GND: C1.1 C2.1 C3.1 D1.1 D2.1 D3.1 D4.1 NOREF#2.3 NOREF#4.2 R1.1 R66.2 R121.1 R125.1 SW1.2 SW2.2 U1.77 U1.78 U1.79 U1.80 U1.81 U1.82 U1.83 U1.84 U1.85 U1.86 U1.87 U1.88 U2.4 U2.5 U2.6 U2.8 U2.9 U2.10 U2.11 U2.12 U2.13 U2.14 U2.15 U2.77 U2.78 U2.79 U2.80 U2.81 U2.82 U2.83 U2.84 U2.85 U2.86 U2.87 U2.88 U2.91 U2.92 U2.93 U2.94 U2.95 U9.1 U9.2 U9.3 U9.4 U9.5 U9.6 USB1.1 USB1.GND1 USB1.GND2 USB2.1 USB2.GND1 USB2.GND2
VCC_3V3: LED1.2 NOREF#5.3 U1.116 U1.117 U2.116 U2.117 U9.18 U9.20
TFT_BLK: NOREF#6.1 U1.97
UART2_RX_M0_DEBUG: NOREF.2 U1.119 U2.119
UART2_TX_M0_DEBUG: NOREF#3.1 U1.118 U2.118

Pads without a net: U1 1 4 5 6 8 9 10 11 12 13 14 15 20 100 101 102 103 104 105; U2 1 20 96 97 98 100 101 102 103 104 105; U8 13 14 15 16; U9 7 8 11 12 15 16 21 22 23 24; USB1 A8 B8; USB2 A5 A8 B5 B8

## Via types
v1: diameter 0.399, hole 0.299, Top Layer to Bottom Layer, 216 vias
v2: diameter 3.048, hole 2.032, Top Layer to Bottom Layer, 4 vias

## Routing (per net, layer and track width the routed paths; a pad name or vN(x,y) marks a point on that pad's centre or on a via; arc(x,y) is an arc through that point)
GND: length 3.3
  Top Layer w0.127: U9.6 v1(1.3,16.2) ; U9.3 v1(2.7,15.8)
  Bottom Layer w0.254: NOREF#4.2 v1(3.1,10)
  Bottom Layer w0.305: C3.1 48.83,17.57 v1(48.4,18)
  vias: v1(5.5,30.5) v1(5.5,29.5) v1(5.5,28.5) v1(5.5,27.5) v1(5.5,26.5) v1(5.5,25.5) v1(5.5,24.5) v1(5.5,23.5) v1(5.5,22.5) v1(5.5,21.5) v1(5.5,20.5) v1(5.5,19.5) v1(5.84,30) v1(5.84,29) v1(5.84,28) v1(5.84,27) v1(5.84,26) v1(5.84,25) v1(5.84,24) v1(5.84,23) v1(5.84,22) v1(5.84,21) v1(5.84,20) v1(10,33.8) v1(12,33.8) v2(2,34) v2(2,2) v2(50,34) v2(50,2)
VCC1V8_DDR:
  vias: v1(39.5,32.5)
VCC3V3_PMU:
  vias: v1(44.5,13.5)
VCC_1V8:
  vias: v1(44.5,24.5)
VCC_3V3: length 56.6
  Top Layer w0.203: v1(1.3,18.5) 1.2,18.6 U9.18 ; v1(1.3,19.1) 1.2,19 U9.20
  PWR w0.254: v1(1.96,14) 1.96,17.84 v1(1.3,18.5)
  PWR w0.508: 34.5,31.9 v1(34.5,32.5) 35.1,32.5 ; 34.5,31.9 32.7,30.1 7.19,30.1 6.09,31.2 5.2,31.2 4.5,30.5 4.5,22.5 1.3,19.3 v1(1.3,19.1) v1(1.3,18.5) ; 34.5,31.9 35.1,32.5 ; 35.1,32.5 v1(35.5,32.5)
  Bottom Layer w0.254: v1(1.96,14) 1.97,14 LED1.2 2.8,12.8 NOREF#5.3
VCC_5V: length 81.4
  Top Layer w0.381: USB2.5V_2 47.74,28.39 48.8,27.34 48.8,24.7 ; 48.8,19 49.3,19.5 49.3,24.2 48.8,24.7 ; 48.8,24.7 47.71,23.61 USB2.5V_1
  Top Layer w0.508: v1(46.1,28.39) v1(46.1,27.7) ; v1(46.1,28.39) v1(46.1,29.09) v1(46.1,29.78) ; v1(46.1,28.39) USB2.5V_2 ; v1(46.1,6.22) v1(46.1,6.91) v1(46.1,7.61) ; USB1.5V_1 v1(46.1,7.61) ; v1(46.1,7.61) v1(46.1,8.3) ; v1(46.1,23.61) v1(46.1,24.3) ; v1(46.1,23.61) USB2.5V_1 ; v1(46.1,23.61) v1(46.1,22.91) v1(46.1,22.22) ; v1(46.1,12.4) v1(46.1,11.7) ; v1(46.1,12.4) 47.08,12.4 USB1.5V_2 ; v1(46.1,12.4) v1(46.1,13.09) v1(46.1,13.79) v1(46.1,14.48) 46.1,14.8 46.9,15.6 ; 49.4,16 48.13,16 48.12,15.99 47.29,15.99 46.9,15.6 ; v1(49.4,15.6) v1(48.8,15.6) 46.9,15.6
  PWR w0.508: 49.7,19.81 49.1,19.21 49.1,17.1 v1(49.4,16.8) ; 49.7,19.81 49.7,23.2 48.6,24.3 v1(46.1,24.3) ; 49.7,19.81 49.9,19.61 50,19.61 50.39,19.21 50.39,17.55 50.4,17.54 50.4,15.4 v1(50,15) v1(49.4,15) v1(48.8,15.6) 46.9,15.6 46.1,14.8 v1(46.1,14.48) v1(46.1,13.79) v1(46.1,13.09) v1(46.1,12.4) v1(46.1,11.7) 45.4,11 45.4,9 v1(46.1,8.3) v1(46.1,7.61) v1(46.1,6.91) v1(46.1,6.22) ; v1(46.1,24.3) 45.4,25 45.4,26.6 46.1,27.3 v1(46.1,27.7) v1(46.1,28.39) v1(46.1,29.09) v1(46.1,29.78) ; v1(46.1,24.3) v1(46.1,23.61) v1(46.1,22.91) v1(46.1,22.22)
  Bottom Layer w0.254: 46.56,8.07 46.33,8.07 v1(46.1,8.3) 46.1,7.94 ; 46.56,8.07 R68.2 ; 46.56,8.07 46.44,7.94 ; v1(46.1,7.61) 46.1,7.94 ; v1(46.1,7.61) 46.44,7.94 ; v1(46.1,7.61) v1(46.1,6.91) v1(46.1,6.22) ; 46.1,7.94 46.44,7.94
  Bottom Layer w0.508: Q1.1 46.7,18.15 C1.2 C2.2 48.29,16.81 D5.2 50.17,16.27 R1.2
  vias: v1(48.8,16.8) v1(48.8,16.2) v1(49.4,16.2)
VCC_DDR: length 32.3
  Top Layer w0.381: v1(5.5,17.5) v1(5.5,18.5) 5.84,18.16 v1(5.84,18) 5.84,17.84 ; v1(5.5,17.5) 5.84,17.84 ; v1(5.5,17.5) 5.84,17.16 ; v1(5.5,17.5) v1(5.5,16.5) ; v1(5.5,16.5) v1(5.5,15.5) ; v1(5.5,16.5) 5.84,16.84 ; v1(5.5,16.5) 5.84,16.16 ; v1(5.5,15.5) 5.84,15.84 ; v1(5.5,15.5) v1(5.5,14.5) ; v1(5.5,15.5) 5.84,15.16 ; 5.84,15.84 v1(5.84,16) 5.84,16.16 ; 5.84,15.84 5.84,15.16 ; 5.84,17.84 5.84,17.16 ; 5.84,15.16 v1(5.84,15) 5.84,14.84 ; 5.84,17.16 v1(5.84,17) 5.84,16.84 ; v1(5.5,14.5) 5.84,14.84 ; v1(5.5,14.5) v1(5.5,13.5) 5.84,13.84 5.84,14.16 ; v1(5.5,14.5) 5.84,14.16 ; 5.84,14.84 5.84,14.16 ; v1(4.5,13.5) v1(4.5,14.5) v1(4.5,15.5) ; 5.84,16.84 5.84,16.16
  Bottom Layer w0.381: 5.84,17.16 v1(5.84,17) 5.84,16.84 ; 5.84,17.16 v1(5.5,17.5) ; 5.84,17.16 5.84,17.84 ; 5.84,14.84 v1(5.84,15) 5.84,15.16 ; 5.84,14.84 5.84,14.16 ; 5.84,14.84 v1(5.5,14.5) ; v1(5.5,17.5) 5.84,17.84 ; v1(5.5,17.5) v1(5.5,16.5) ; v1(5.5,17.5) v1(5.5,18.5) 5.84,18.16 v1(5.84,18) 5.84,17.84 ; v1(5.5,15.5) 5.84,15.84 ; v1(5.5,15.5) 5.84,15.16 ; v1(5.5,15.5) v1(5.5,16.5) ; v1(5.5,15.5) v1(5.5,14.5) ; 5.84,15.84 5.84,15.16 ; 5.84,15.84 v1(5.84,16) 5.84,16.16 ; 5.84,14.16 v1(5.84,14) 5.84,13.84 v1(5.5,13.5) v1(5.5,14.5) ; 5.84,14.16 v1(5.5,14.5) ; 5.84,16.84 5.84,16.16 ; 5.84,16.84 v1(5.5,16.5) ; 5.84,16.16 v1(5.5,16.5) ; v1(4.5,15.5) v1(4.5,14.5) v1(4.5,13.5)
VCC_IN: length 16.7
  PWR w0.508: v1(46,20.9) v1(46,20.25) v1(46,19.6) v1(46,19) 43.8,16.8 v1(43.8,8.9)
  Bottom Layer w0.61: D5.1 50.64,20.25 v1(48.4,20.25) v1(47.75,20.25) Q1.2
  vias: v1(42.6,7.7) v1(42.6,7.1) v1(43.19,9.5) v1(43.2,8.9) v1(43.2,8.3) v1(43.2,7.7) v1(43.79,9.5) v1(43.81,8.3) v1(43.81,7.7) v1(46.6,20.9) v1(46.6,19.6)
VCC_OUT: length 0.9
  Bottom Layer w0.508: Q1.3 49.1,19.1 C3.2
  vias: v1(49.75,19) v1(49.75,18.4) v1(49.75,17.8) v1(51,19) v1(51,18.4) v1(51,17.8) v1(51.6,19) v1(51.6,18.4) v1(51.6,17.8)
VCCA1V8_IMAGE:
  vias: v1(44.5,28.5)
VCCA_1V8: length 46
  Top Layer w0.254: R120.1 2.63,23.7 3.9,24.97 3.9,30.9 4.5,31.5 6.6,31.5 7.6,30.5 28.2,30.5 28.8,31.1 33.4,31.1 34.1,31.8 39.8,31.8 v1(40.5,32.5)
VCCIO_ACODEC:
  vias: v1(42.5,32.5)
VCCIO_SD:
  vias: v1(17.5,32.5)
VDD_CPU: length 31.5
  Top Layer w0.381: v1(26.5,4.3) 26.1,3.9 ; v1(26.5,4.3) v1(25.5,4.3) ; v1(26.5,4.3) 26.9,3.9 ; 26.1,3.9 v1(26,3.9) ; 26.1,3.9 26.9,3.9 ; 26.1,3.9 v1(26,3.9) ; 26.1,3.9 v1(26.5,3.5) ; 24.9,3.9 24.1,3.9 ; 24.9,3.9 v1(24.5,4.3) ; 24.9,3.9 v1(24.5,3.5) ; 24.9,3.9 v1(25,3.9) 25.1,3.9 ; 24.1,3.9 v1(24.5,4.3) ; 24.1,3.9 v1(24.5,3.5) ; 24.1,3.9 v1(24,3.9) ; v1(24.5,4.3) v1(25.5,4.3) ; v1(25.5,4.3) 25.1,3.9 ; v1(25.5,4.3) 25.9,3.9 ; 25.1,3.9 v1(25.5,3.5) ; 25.1,3.9 25.9,3.9 ; v1(26,3.9) 25.9,3.9 ; v1(26,3.9) 25.9,3.9 ; v1(26.5,3.5) v1(25.5,3.5) ; v1(26.5,3.5) v1(27.5,3.5) 27.1,3.9 26.9,3.9 ; v1(26.5,3.5) 26.9,3.9 ; v1(25.5,3.5) v1(24.5,3.5) ; v1(25.5,3.5) 25.9,3.9 ; 26.9,3.9 v1(27,3.9)
  Bottom Layer w0.381: 24.9,3.9 24.1,3.9 ; 24.9,3.9 v1(24.5,3.5) ; 24.9,3.9 v1(25,3.9) 25.1,3.9 ; 24.9,3.9 v1(24.5,4.3) ; 24.1,3.9 v1(24.5,3.5) ; 24.1,3.9 v1(24,3.9) ; 24.1,3.9 v1(24.5,4.3) ; v1(26.5,3.5) 26.9,3.9 ; v1(26.5,3.5) v1(27.5,3.5) 27.1,3.9 26.9,3.9 ; v1(26.5,3.5) 26.1,3.9 ; v1(26.5,3.5) v1(25.5,3.5) ; 26.9,3.9 v1(26.5,4.3) ; 26.9,3.9 26.1,3.9 ; 26.9,3.9 v1(27,3.9) ; v1(25.5,3.5) 25.1,3.9 ; v1(25.5,3.5) v1(24.5,3.5) ; v1(25.5,3.5) 25.9,3.9 ; 25.1,3.9 v1(25.5,4.3) ; 25.1,3.9 25.9,3.9 ; v1(26.5,4.3) v1(25.5,4.3) ; v1(26.5,4.3) 26.1,3.9 ; v1(25.5,4.3) 25.9,3.9 ; v1(25.5,4.3) v1(24.5,4.3) ; 26.1,3.9 v1(26,3.9) ; 26.1,3.9 v1(26,3.9) ; 25.9,3.9 v1(26,3.9) ; 25.9,3.9 v1(26,3.9)
VDD_CPU_BACK: length 1.3
  Top Layer w0.381: v1(23.5,3.5) 23.1,3.9 v1(23,3.9)
  Bottom Layer w0.381: v1(23.5,3.5) 23.1,3.9 v1(23,3.9)
VDD_GPU: length 20.4
  Top Layer w0.381: v1(32.5,32.5) 32.9,32.1 ; v1(32.5,32.5) v1(31.5,32.5) ; v1(32.5,32.5) 32.1,32.1 ; v1(32.5,32.5) v1(33.5,32.5) 33.1,32.1 v1(33,32.1) 32.9,32.1 ; 32.9,32.1 v1(32.5,31.7) ; 32.9,32.1 32.1,32.1 ; v1(31.5,32.5) 31.9,32.1 ; v1(31.5,32.5) 31.1,32.1 ; 31.9,32.1 31.1,32.1 ; 31.9,32.1 v1(31.5,31.7) ; 31.9,32.1 v1(32,32.1) 32.1,32.1 ; 32.1,32.1 v1(32.5,31.7) ; v1(32.5,31.7) v1(31.5,31.7) ; v1(31.5,31.7) 31.1,32.1 ; 31.1,32.1 v1(31,32.1)
  Bottom Layer w0.381: 31.1,32.1 31.9,32.1 ; 31.1,32.1 v1(31.5,32.5) ; 31.1,32.1 v1(31.5,31.7) ; 31.1,32.1 v1(31,32.1) ; 31.9,32.1 v1(31.5,32.5) ; 31.9,32.1 v1(31.5,31.7) ; 31.9,32.1 v1(32,32.1) 32.1,32.1 ; v1(31.5,32.5) v1(32.5,32.5) ; 32.9,32.1 v1(33,32.1) 33.1,32.1 v1(33.5,32.5) v1(32.5,32.5) ; 32.9,32.1 32.1,32.1 ; 32.9,32.1 v1(32.5,31.7) ; 32.9,32.1 v1(32.5,32.5) ; 32.1,32.1 v1(32.5,31.7) ; 32.1,32.1 v1(32.5,32.5) ; v1(32.5,31.7) v1(31.5,31.7)
VDD_GPU_BACK: length 1.3
  Top Layer w0.381: v1(30.5,32.5) 30.1,32.1 v1(30,32.1)
  Bottom Layer w0.381: v1(30.5,32.5) 30.1,32.1 v1(30,32.1)
VDD_LOGIC: length 31.3
  Top Layer w0.381: v1(27.5,32.5) v1(26.5,32.5) ; v1(27.5,32.5) v1(28.5,32.5) 28.1,32.1 27.9,32.1 ; v1(27.5,32.5) 27.1,32.1 ; v1(27.5,32.5) 27.9,32.1 ; v1(26.5,32.5) 26.9,32.1 ; v1(26.5,32.5) v1(25.5,32.5) ; v1(26.5,32.5) 26.1,32.1 ; 25.9,32.1 v1(25.5,32.5) ; 25.9,32.1 25.1,32.1 ; 25.9,32.1 v1(25.5,31.7) ; 25.9,32.1 v1(26,32.1) 26.1,32.1 ; v1(25.5,32.5) 25.1,32.1 ; 26.9,32.1 v1(27,32.1) 27.1,32.1 ; 26.9,32.1 26.1,32.1 ; 26.9,32.1 v1(26.5,31.7) ; 26.1,32.1 v1(26.5,31.7) ; v1(26.5,31.7) v1(27.5,31.7) ; v1(26.5,31.7) v1(25.5,31.7) ; v1(27.5,31.7) 27.1,32.1 ; v1(27.5,31.7) 27.9,32.1 ; 27.9,32.1 27.1,32.1 ; v1(25.5,31.7) 25.1,32.1 ; 25.1,32.1 v1(25,32.1)
  Bottom Layer w0.381: 27.9,32.1 v1(28,32.1) ; 27.9,32.1 v1(27.5,31.7) ; 27.9,32.1 28.1,32.1 v1(28.5,32.5) v1(27.5,32.5) ; 27.9,32.1 27.1,32.1 ; 27.9,32.1 v1(27.5,32.5) ; v1(27.5,31.7) v1(26.5,31.7) ; v1(27.5,31.7) 27.1,32.1 ; v1(26.5,31.7) v1(25.5,31.7) ; v1(26.5,31.7) 26.1,32.1 ; v1(26.5,31.7) 26.9,32.1 ; v1(25.5,31.7) 25.1,32.1 ; v1(25.5,31.7) 25.9,32.1 ; v1(27.5,32.5) 27.1,32.1 ; v1(27.5,32.5) v1(26.5,32.5) ; 27.1,32.1 v1(27,32.1) ; 27.1,32.1 v1(27,32.1) ; v1(26.5,32.5) 25.6,32.5 ; v1(26.5,32.5) 26.9,32.1 ; v1(26.5,32.5) 26.1,32.1 ; 25.9,32.1 25.1,32.1 ; 25.9,32.1 v1(25.5,32.5) 25.1,32.1 ; 25.9,32.1 v1(26,32.1) ; 25.9,32.1 v1(26,32.1) ; 25.1,32.1 v1(25,32.1) ; 26.1,32.1 26.9,32.1 ; 26.1,32.1 v1(26,32.1) ; 26.1,32.1 v1(26,32.1) ; 26.9,32.1 v1(27,32.1) ; 26.9,32.1 v1(27,32.1)
VDD_LOGIC_BACK: length 1.3
  Top Layer w0.381: v1(24,32.1) 24.1,32.1 v1(24.5,32.5)
  Bottom Layer w0.381: v1(24,32.1) 24.1,32.1 v1(24.5,32.5)
VDD_NPU: length 30.9
  Top Layer w0.381: v1(33.5,4.3) 33.1,3.9 ; v1(33.5,4.3) v1(34.5,4.3) ; v1(33.5,4.3) 33.9,3.9 ; 33.1,3.9 33.9,3.9 ; 33.1,3.9 v1(33.5,3.5) ; 33.1,3.9 v1(33,3.9) ; 34.9,3.9 v1(35,3.9) 35.1,3.9 ; 34.9,3.9 v1(34.5,4.3) ; 34.9,3.9 v1(34.5,3.5) ; 34.9,3.9 34.1,3.9 ; v1(35.5,4.3) v1(34.5,4.3) ; v1(35.5,4.3) 35.1,3.9 ; v1(35.5,4.3) 35.9,3.9 ; v1(34.5,4.3) 34.1,3.9 ; 35.1,3.9 v1(35.5,3.5) ; 35.1,3.9 35.9,3.9 ; v1(35.5,3.5) 35.9,3.9 ; v1(35.5,3.5) v1(36.5,3.5) 36.1,3.9 35.9,3.9 ; v1(35.5,3.5) v1(34.5,3.5) ; 33.9,3.9 v1(34,3.9) 34.1,3.9 ; 33.9,3.9 v1(33.5,3.5) ; v1(34.5,3.5) v1(33.5,3.5) ; v1(34.5,3.5) 34.1,3.9
  Bottom Layer w0.381: 33.9,3.9 v1(34,3.9) 34.1,3.9 ; 33.9,3.9 33.1,3.9 ; 33.9,3.9 v1(33.5,3.5) ; 33.9,3.9 v1(33.5,4.3) ; v1(35.5,4.3) 35.1,3.9 ; v1(35.5,4.3) v1(34.5,4.3) ; v1(35.5,4.3) 35.9,3.9 ; 35.1,3.9 35.9,3.9 ; 35.1,3.9 v1(35.5,3.5) ; 35.1,3.9 v1(35,3.9) 34.9,3.9 ; v1(35.5,3.5) v1(36.5,3.5) 36.1,3.9 35.9,3.9 ; v1(35.5,3.5) 35.9,3.9 ; v1(35.5,3.5) v1(34.5,3.5) ; 33.1,3.9 v1(33.5,3.5) ; 33.1,3.9 v1(33,3.9) ; 33.1,3.9 v1(33.5,4.3) ; v1(34.5,4.3) 34.9,3.9 ; v1(34.5,4.3) 34.1,3.9 ; v1(34.5,4.3) v1(33.5,4.3) ; 34.9,3.9 v1(34.5,3.5) ; 34.9,3.9 34.1,3.9 ; v1(34.5,3.5) 34.1,3.9 ; v1(34.5,3.5) v1(33.5,3.5)
  vias: v1(36,3.9)
VDD_NPU_BACK: length 1.3
  Top Layer w0.381: v1(37.5,3.5) 37.1,3.9 v1(37,3.9)
  Bottom Layer w0.381: v1(37,3.9) 37.1,3.9 v1(37.5,3.5)
VDDA0V9_IMAGE:
  vias: v1(44.5,29.5)
VDDA0V9_PMU:
  vias: v1(38.5,32.5)
VDDA_0V9:
  vias: v1(41.5,32.5)
$LED1_1: length 1.6
  Bottom Layer w0.127: R124.1 2.38,15 1.38,14 LED1.1
$R66_1: length 5.5
  Top Layer w0.127: USB1.A5 47.85,8.75 48.7,9.6 48.7,10.4 49.2,10.9 v1(50.53,10.9)
  Bottom Layer w0.127: R66.1 v1(50.53,10.9)
$R117_2: length 1.5
  Top Layer w0.127: R117.2 1.57,11.13 2,10.7 SW1.1
$R119_1: length 2.3
  Top Layer w0.254: R120.2 R119.1 1.57,25.38 SW2.1
$R121_2: length 4
  Top Layer w0.127: v1(50.5,11.57) 50.31,11.75 USB1.B5
  Bottom Layer w0.127: R121.2 v1(50.5,11.57)
BT_REG_ON_H:
  vias: v1(39.5,3.5)
BT_WAKE_HOST_H:
  vias: v1(32.5,3.5)
EMMC_CLKOUT:
  vias: v1(16.5,3.5)
EMMC_CMD:
  vias: v1(13.5,3.5)
EMMC_D0:
  vias: v1(20.5,3.5)
EMMC_D1:
  vias: v1(14.5,3.5)
EMMC_D2:
  vias: v1(19.5,3.5)
EMMC_D3:
  vias: v1(15.5,3.5)
EMMC_D4:
  vias: v1(22.5,3.5)
EMMC_D5:
  vias: v1(17.5,3.5)
EMMC_D6:
  vias: v1(18.5,3.5)
EMMC_D7:
  vias: v1(21.5,3.5)
EMMC_DATA_STROBE:
  vias: v1(12.5,3.5)
EMMC_RSTN:
  vias: v1(11.5,3.5)
HOST_WAKE_BT_H:
  vias: v1(31.5,3.5)
I2C0_SCL_PMIC:
  vias: v1(44.5,14.5)
I2C0_SDA_PMIC:
  vias: v1(44.5,15.5)
I2S1_LRCK_TX_M0_PMIC:
  vias: v1(5.5,10.5)
I2S1_MCLK_M0_PMIC:
  vias: v1(5.5,12.5)
I2S1_SCLK_TX_M0_PMIC:
  vias: v1(5.5,11.5)
I2S1_SDI0_M0/PDM:
  vias: v1(8.5,32.5)
I2S1_SDO0_M0_PMIC:
  vias: v1(5.5,9.5)
I2S2_LRCK_TX_M0:
  vias: v1(8.5,3.5)
I2S2_SCLK_TX_M0:
  vias: v1(38.5,3.5)
I2S2_SDI_M0:
  vias: v1(40.5,3.5)
I2S2_SDO_M0:
  vias: v1(5.5,5.5)
LED: length 26.7
  Bottom Layer w0.127: R124.2 0.7,15.87 0.7,19.37 1.03,19.7 2.5,19.7 2.96,20.16 2.96,31.46 5.4,33.9 8.9,33.9 9.5,33.3 U1.91
LEDK: length 5.3
  Top Layer w0.203: 2.8,19 2.8,22.53 R125.2 ; 2.8,19 3.2,18.6 U9.17 ; 2.8,19 U9.19
PDM_CLK0_M0_PMIC:
  vias: v1(7.5,32.5)
PMIC_INT_L:
  vias: v1(44.5,10.5)
PMIC_SLEEP_H:
  vias: v1(44.5,9.5)
RESETN: length 53.5
  Top Layer w0.127: R117.1 3.3,11.5 4,10.8 4,5.3 4.6,4.7 5.5,4.7 6,5.2 6,6.9 6.8,7.7 41.1,7.7 42.6,9.2 42.6,9.81 42.89,10.1 43.5,10.1 44.1,10.7 44.1,12.1 v1(44.5,12.5)
SARADC_VIN0: length 34.4
  Top Layer w0.127: R119.2 3.4,25.47 3.4,31 4.3,31.9 7,31.9 7.9,31 28,31 v1(29.5,32.5)
SDMMC1_CLK:
  vias: v1(10.5,3.5)
SDMMC1_CMD:
  vias: v1(30.5,3.5)
SDMMC1_D0:
  vias: v1(5.5,7.5)
SDMMC1_D1:
  vias: v1(9.5,3.5)
SDMMC1_D2:
  vias: v1(5.5,8.5)
SDMMC1_D3:
  vias: v1(5.5,6.5)
SPI3_CLK_M1: length 24.5
  Top Layer w0.127: U9.13 v1(2.7,17.8)
  Bottom Layer w0.127: v1(2.7,17.8) 3.3,18.4 3.3,31.3 4.08,32.08 11.98,32.08 12.5,32.6 U1.94
SPI3_MOSI_M1: length 29.4
  Top Layer w0.127: U9.14 v1(1.3,17.8)
  Bottom Layer w0.127: v1(1.3,17.8) 2.52,16.58 3.08,16.58 3.92,17.42 3.92,31.02 4.3,31.4 13.4,31.4 14.5,32.5 U1.96
TFT_BLK: length 38.5
  PWR w0.254: v1(0.6,8) 0.6,19.8 3.7,22.9 3.7,30.9 4.8,32 v1(15,32)
  Bottom Layer w0.254: v1(15,32) 15.5,32.5 U1.97 ; v1(0.6,8) NOREF#6.1
TFT_DC: length 31.3
  Top Layer w0.127: U9.10 v1(1.3,17)
  Bottom Layer w0.127: U1.98 16.5,32.6 15,31.1 4.5,31.1 4.2,30.8 4.2,17.1 3.4,16.3 2,16.3 v1(1.3,17)
TFT_REC: length 26.1
  Top Layer w0.127: U9.9 v1(2.7,17)
  Bottom Layer w0.127: v1(2.7,17) 3.6,17.9 3.6,31.1 4.2,31.7 12.7,31.7 13.5,32.5 U1.95
UART1_CTSN_M0:
  vias: v1(42.5,3.5)
UART1_RTSN_M0:
  vias: v1(41.5,3.5)
UART1_RX_M0:
  vias: v1(7.5,3.5)
UART1_TX_M0:
  vias: v1(44.5,5.5)
UART2_RX_M0_DEBUG: length 2
  Top Layer w0.127: 37.46,35 37.5,34.96 U2.119
  vias: v1(37.5,32.5)
UART2_TX_M0_DEBUG: length 2.7
  Top Layer w0.127: U2.118 36.5,33.4 34.92,34.98 34.92,35
  vias: v1(36.5,32.5)
USB2_HOST2_DM: length 43.7
  Bottom Layer w0.122: R73.1 50.4,29.84 50.12,30.11 50.12,30.73 46.3,34.55 11.3,34.55 10.88,34.13 10.88,33.68 10.5,33.3 U1.92
USB2_HOST2_DP: length 43.7
  Bottom Layer w0.122: R75.1 49.6,29.84 49.88,30.11 49.88,30.62 49.7,30.8 49.5,30.8 49.39,30.91 49.39,31.11 49.27,31.23 49.07,31.23 48.96,31.34 48.96,31.54 48.84,31.66 48.64,31.66 48.53,31.77 48.53,31.97 48.41,32.09 48.21,32.09 48.1,32.2 48.1,32.4 47.98,32.52 47.78,32.52 47.66,32.64 47.66,32.84 47.55,32.95 47.35,32.95 47.23,33.07 47.23,33.27 47.12,33.38 46.92,33.38 46.8,33.5 46.8,33.7 46.2,34.3 11.4,34.3 11.12,34.02 11.12,33.68 11.5,33.3 U1.93
USB_HOST2_N: length 10.5
  Top Layer w0.127: USB2.B7 46.25,25.25 v1(46.1,25.4) 46.1,26.1 46.25,26.25 USB2.A7
  Bottom Layer w0.122: v1(46.1,25.4) 46.3,25.6 47.32,25.6 47.76,25.16 49.56,25.16 50.12,25.72 50.12,26.77 50.47,27.11 D2.2 50.47,27.54 50.21,27.8 50.21,28.38 R73.2
USB_HOST2_P: length 10.5
  Top Layer w0.127: USB2.B6 47.94,26.75 v1(48.1,26.6) 48.1,25.9 47.96,25.75 USB2.A6
  Bottom Layer w0.122: R75.2 49.79,28.38 49.79,27.8 49.53,27.54 D1.2 49.53,27.11 49.88,26.77 49.88,25.83 49.46,25.41 49.22,25.41 49.13,25.5 49.13,25.61 49.04,25.7 48.91,25.7 48.83,25.61 48.83,25.5 48.74,25.41 48.61,25.41 48.52,25.5 48.52,25.61 48.44,25.7 48.3,25.7 48.22,25.61 48.22,25.5 48.13,25.41 47.86,25.41 47.5,25.77 47.5,26.2 47.9,26.6 v1(48.1,26.6)
USB_OTG0_N: length 10.9
  Top Layer w0.127: USB1.A7 46.25,10.25 v1(46.1,10.1) 46.1,9.4 46.25,9.25 USB1.B7
  Bottom Layer w0.122: R77.2 50.2,7.63 50.2,8.13 50.47,8.4 D3.2 50.47,8.89 50.12,9.23 50.12,10.68 49.86,10.94 47.5,10.94 46.66,10.1 v1(46.1,10.1)
USB_OTG0_P: length 10.9
  Top Layer w0.127: USB1.B6 47.94,10.75 48.1,10.6 v1(48.1,9.9) 47.96,9.75 USB1.A6
  Bottom Layer w0.122: v1(48.1,9.9) 47.4,9.9 47.2,10.1 47.2,10.28 47.61,10.69 47.9,10.69 48.03,10.56 48.21,10.56 48.33,10.69 48.51,10.69 48.64,10.56 48.82,10.56 48.94,10.69 49.12,10.69 49.25,10.56 49.43,10.56 49.55,10.69 49.76,10.69 49.88,10.57 49.88,9.91 49.79,9.82 49.79,9.82 49.7,9.73 49.7,9.6 49.79,9.51 49.79,9.51 49.88,9.43 49.88,9.23 49.53,8.89 D4.2 49.53,8.4 49.8,8.13 49.8,7.63 R72.2
USB_OTG0_VBUSDET: length 2.3
  Bottom Layer w0.254: R68.1 47.03,9 45.9,9 45.4,8.5 U1.23
USB_OTG_DM: length 13.9
  Bottom Layer w0.122: R77.1 50.4,6.16 50.12,5.89 50.12,4.52 49.55,3.95 43.75,3.95 43.15,4.55 43.15,6.6 43.67,7.12 44.22,7.12 44.6,7.5 U1.24
USB_OTG_DP: length 13.9
  Bottom Layer w0.122: U1.25 44.6,6.5 44.22,6.88 43.78,6.88 43.4,6.5 43.4,6.01 43.53,5.89 43.53,5.71 43.4,5.58 43.4,5.4 43.53,5.28 43.53,5.1 43.4,4.97 43.4,4.65 43.85,4.2 44.16,4.2 44.28,4.33 44.46,4.33 44.59,4.2 44.76,4.2 44.89,4.33 45.07,4.33 45.2,4.2 45.37,4.2 45.5,4.33 45.68,4.33 45.81,4.2 45.98,4.2 46.11,4.33 46.29,4.33 46.42,4.2 46.59,4.2 46.72,4.33 46.9,4.33 47.03,4.2 47.2,4.2 47.33,4.33 47.51,4.33 47.63,4.2 47.81,4.2 47.94,4.33 48.12,4.33 48.24,4.2 48.42,4.2 48.55,4.33 48.73,4.33 48.85,4.2 49.45,4.2 49.88,4.63 49.88,5.08 49.79,5.16 49.79,5.16 49.7,5.25 49.7,5.38 49.79,5.47 49.79,5.47 49.88,5.56 49.88,5.89 49.6,6.16 R72.1
WIFI_REG_ON_H:
  vias: v1(29.5,3.5)
WIFI_WAKE_HOST_H:
  vias: v1(28.5,3.5)

## Copper pours and planes (outline as drawn; the poured copper is in the pictures)
GND on Top Layer: -0.2,36.2 52.2,36.2 52.2,-0.2 -0.2,-0.2
GND on Bottom Layer: -0.2,36.2 52.2,36.2 52.2,-0.2 -0.2,-0.2
GND on PWR: -0.2,36.2 52.2,36.2 52.2,-0.2 -0.2,-0.2
GND on GND: -0.2,36.2 52.2,36.2 52.2,-0.2 -0.2,-0.2
VCC_5V on Top Layer: 47.4,19.2 47.1,18.9 47.1,17 47.3,16.8 47.9,16.8 48.1,16.6 48.1,15.6 49.1,14.6 50.26,14.6 50.58,14.92 50.58,15.62 49.7,16.5 49.7,16.8 49.4,17.1 49.4,18.9 49.1,19.2
VCC_5V on Bottom Layer: 46.2,18.7 46.3,18.8 47.5,18.8 47.7,18.6 47.7,18.3 48.8,17.2 49.8,17.2 50,17.4 51.3,17.4 51.4,17.3 51.4,16.4 51.3,16.3 50.7,16.3 50.5,16.1 50.5,14.9 50.3,14.7 49.2,14.7 48.5,15.4 48.5,16.2 48.3,16.4 46.6,16.4 46.2,16.8
VCC_5V on PWR: 45.8,5.4 46.4,5.4 47.7,6.7 47.7,7.3 50.2,9.8 50.2,11.8 50.9,12.5 50.9,26.3 49,28.2 48,28.2 47.6,28.6 47.6,29 46.4,30.2 45.6,30.2 45,29.6 45,22.3 45.5,21.8 46.7,21.8 47.1,22.2 48.5,22.2 49,21.7 49,20 47.8,18.8 46.7,18.8 44.9,17 44.9,6.3
VCC_IN on Top Layer: 44.6,9 43.8,9.8 43,9.8 42.8,9.6 42.8,9.1 42.2,8.5 42.2,6.67 42.86,6.01 45.41,6.01 45.7,6.3 45.7,8.7 45.4,9
VCC_IN on Bottom Layer: 45.7,21 45.7,18.9 45.8,18.8 46.2,18.8 46.3,18.9 47.7,18.9 48.1,19.3 48.1,19.7 48.2,19.8 49.7,19.8 49.9,19.6 51.3,19.6 51.4,19.7 51.4,20.8 51.2,21 47,21 46.8,21.2 45.9,21.2
VCC_IN on PWR: 46.4,21.6 47.1,20.9 48.5,20.9 48.7,20.7 48.7,19.9 47.7,18.9 46.5,18.9 44.2,16.6 44.2,7.2 43.6,6.6 42.4,6.6 42,7 42,8.8 42.3,9.1 42.3,18.8 45.1,21.6
VCC_OUT on Top Layer: 49.7,19.2 49.5,19 49.5,17.2 49.9,16.8 51.31,16.8 52,17.49 52,19 51.8,19.2
VCC_OUT on Bottom Layer: 48.18,19.6 48.28,19.7 49.6,19.7 49.8,19.5 51.6,19.5 52.1,19 52.1,17.8 51.8,17.5 49.6,17.5 49.1,18 49,18 48.18,18.82

## Text on the board
Bottom Silkscreen Layer: 3V3 | IO | GND
Top Silkscreen Layer: TX | RX | REC | RST
